# EasyEDA Pro project 主控底板.eprj, schematic TMS320F28335_v1

## Sheets
1 coreboard: Board Name: TMS320F28335
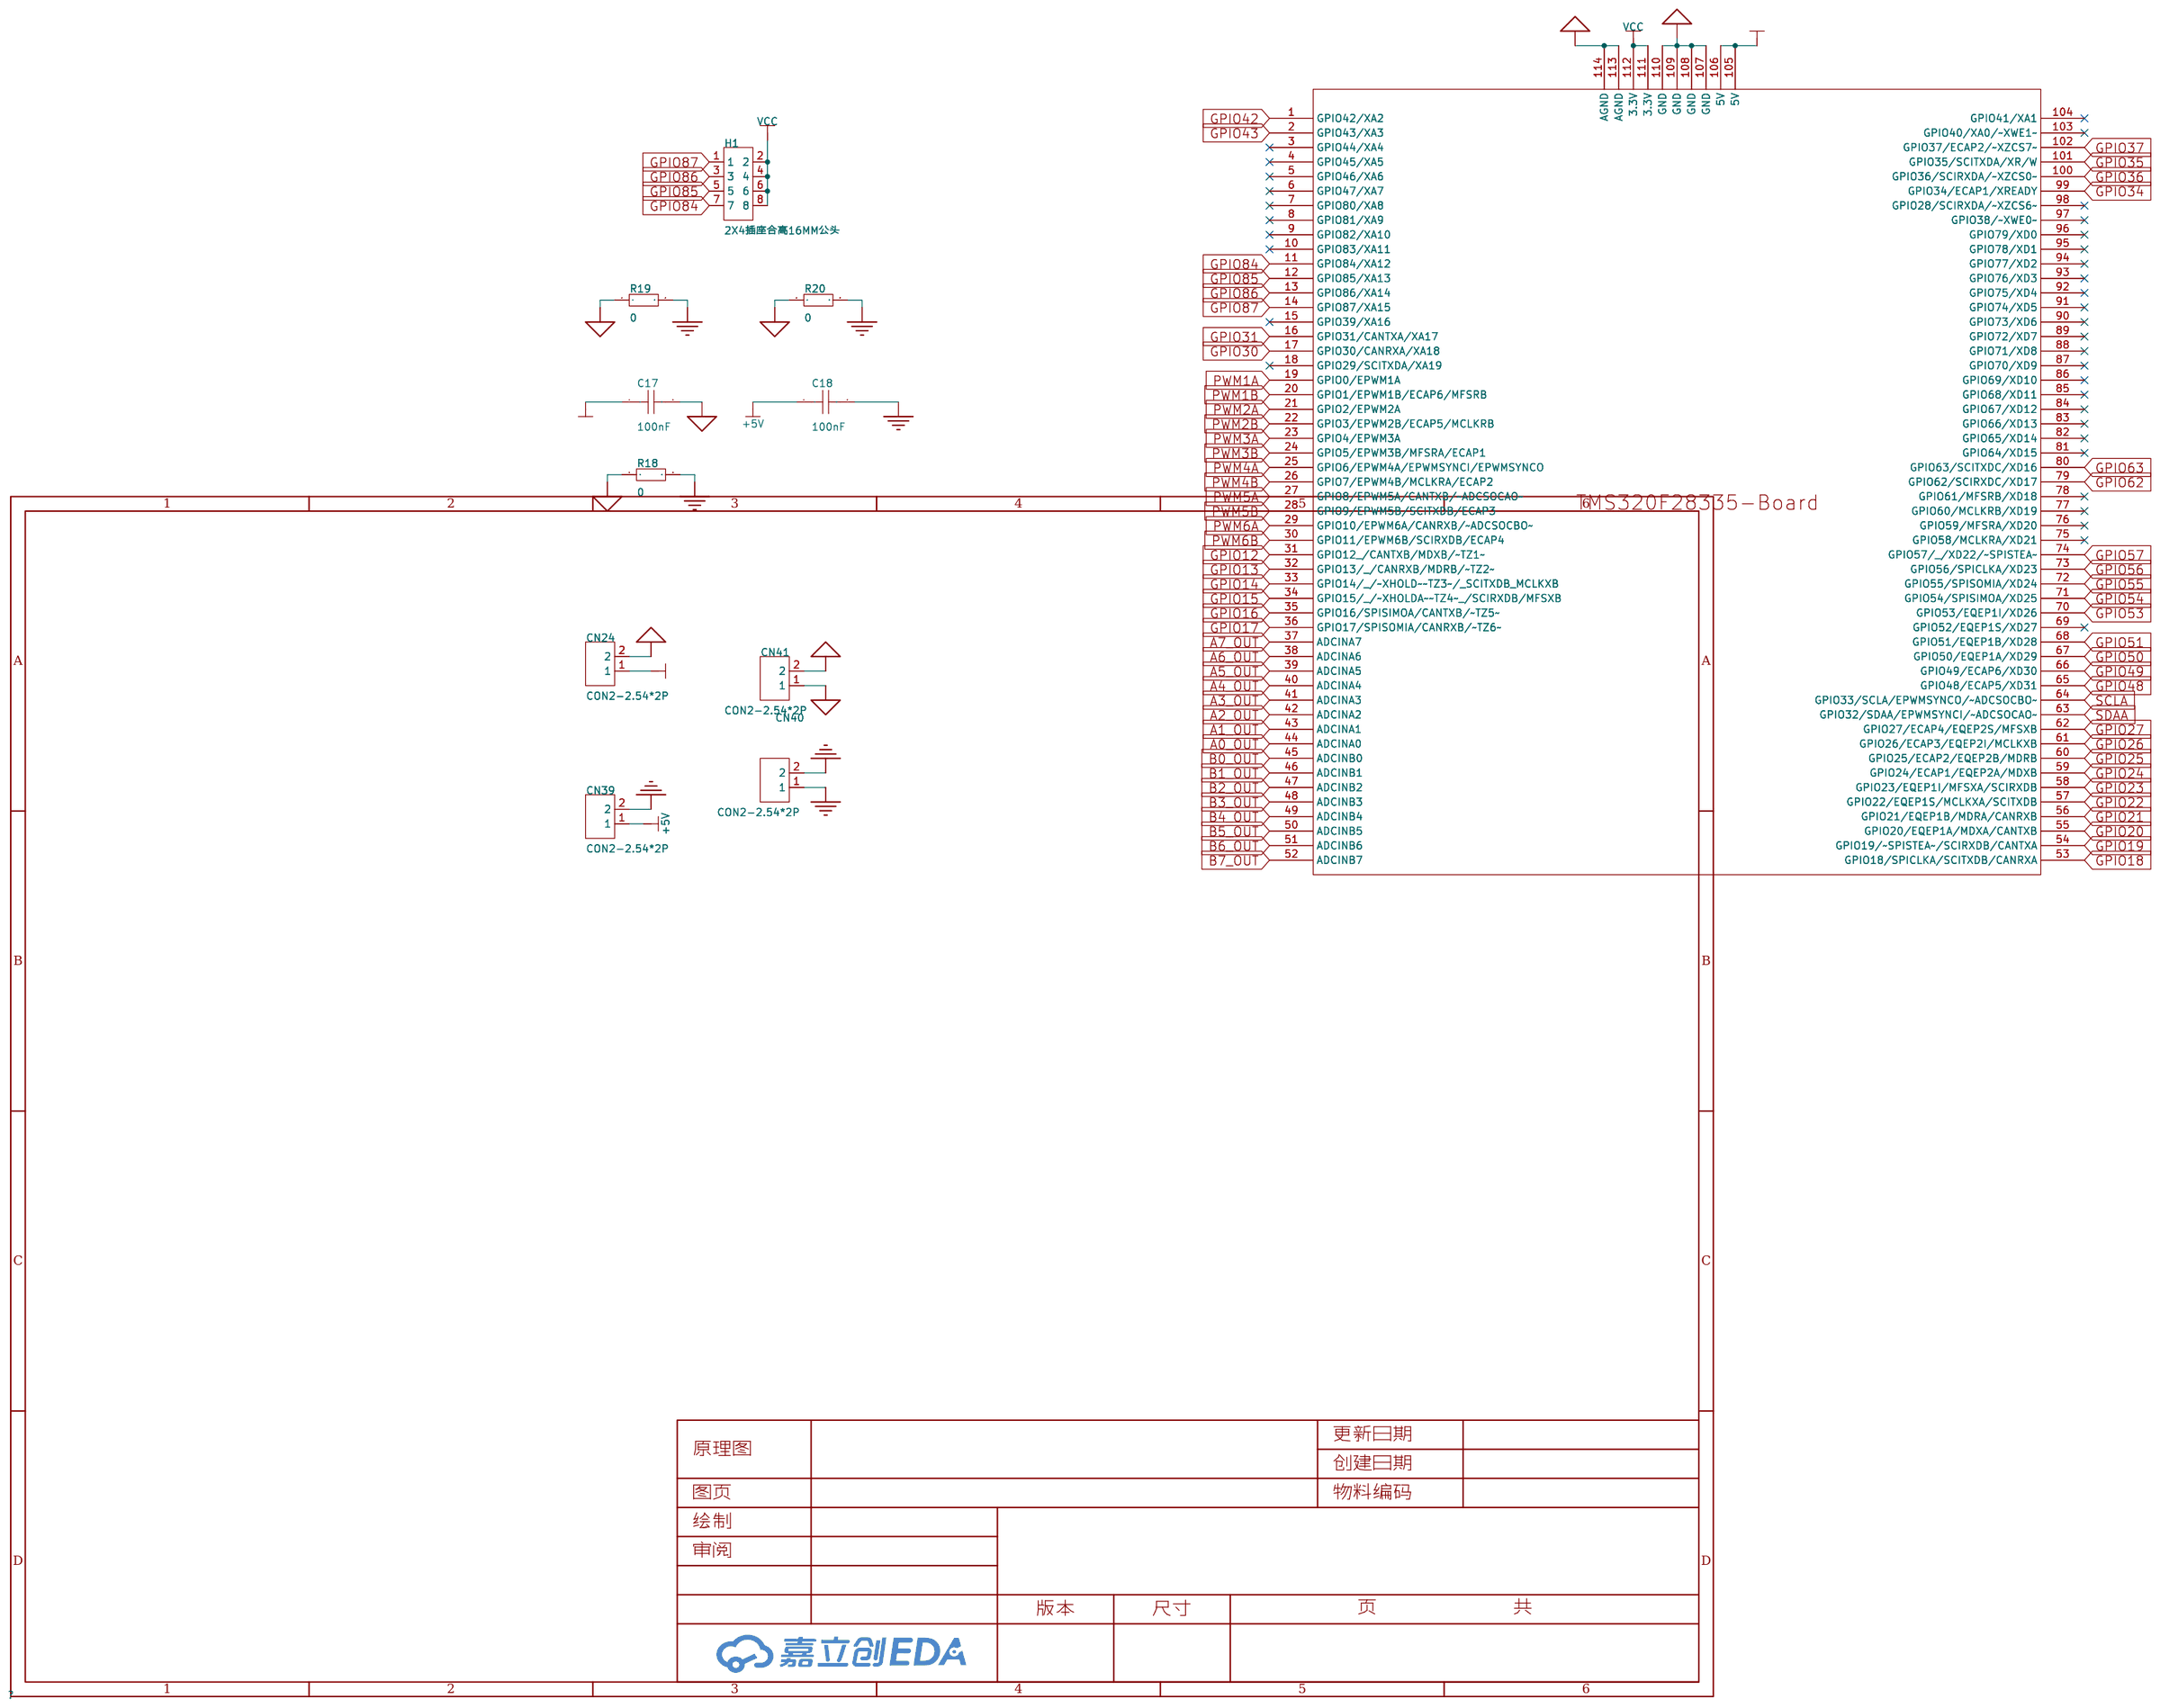
[diagram p0: coreboard]
2 adc: Create Date: 2025-05-22
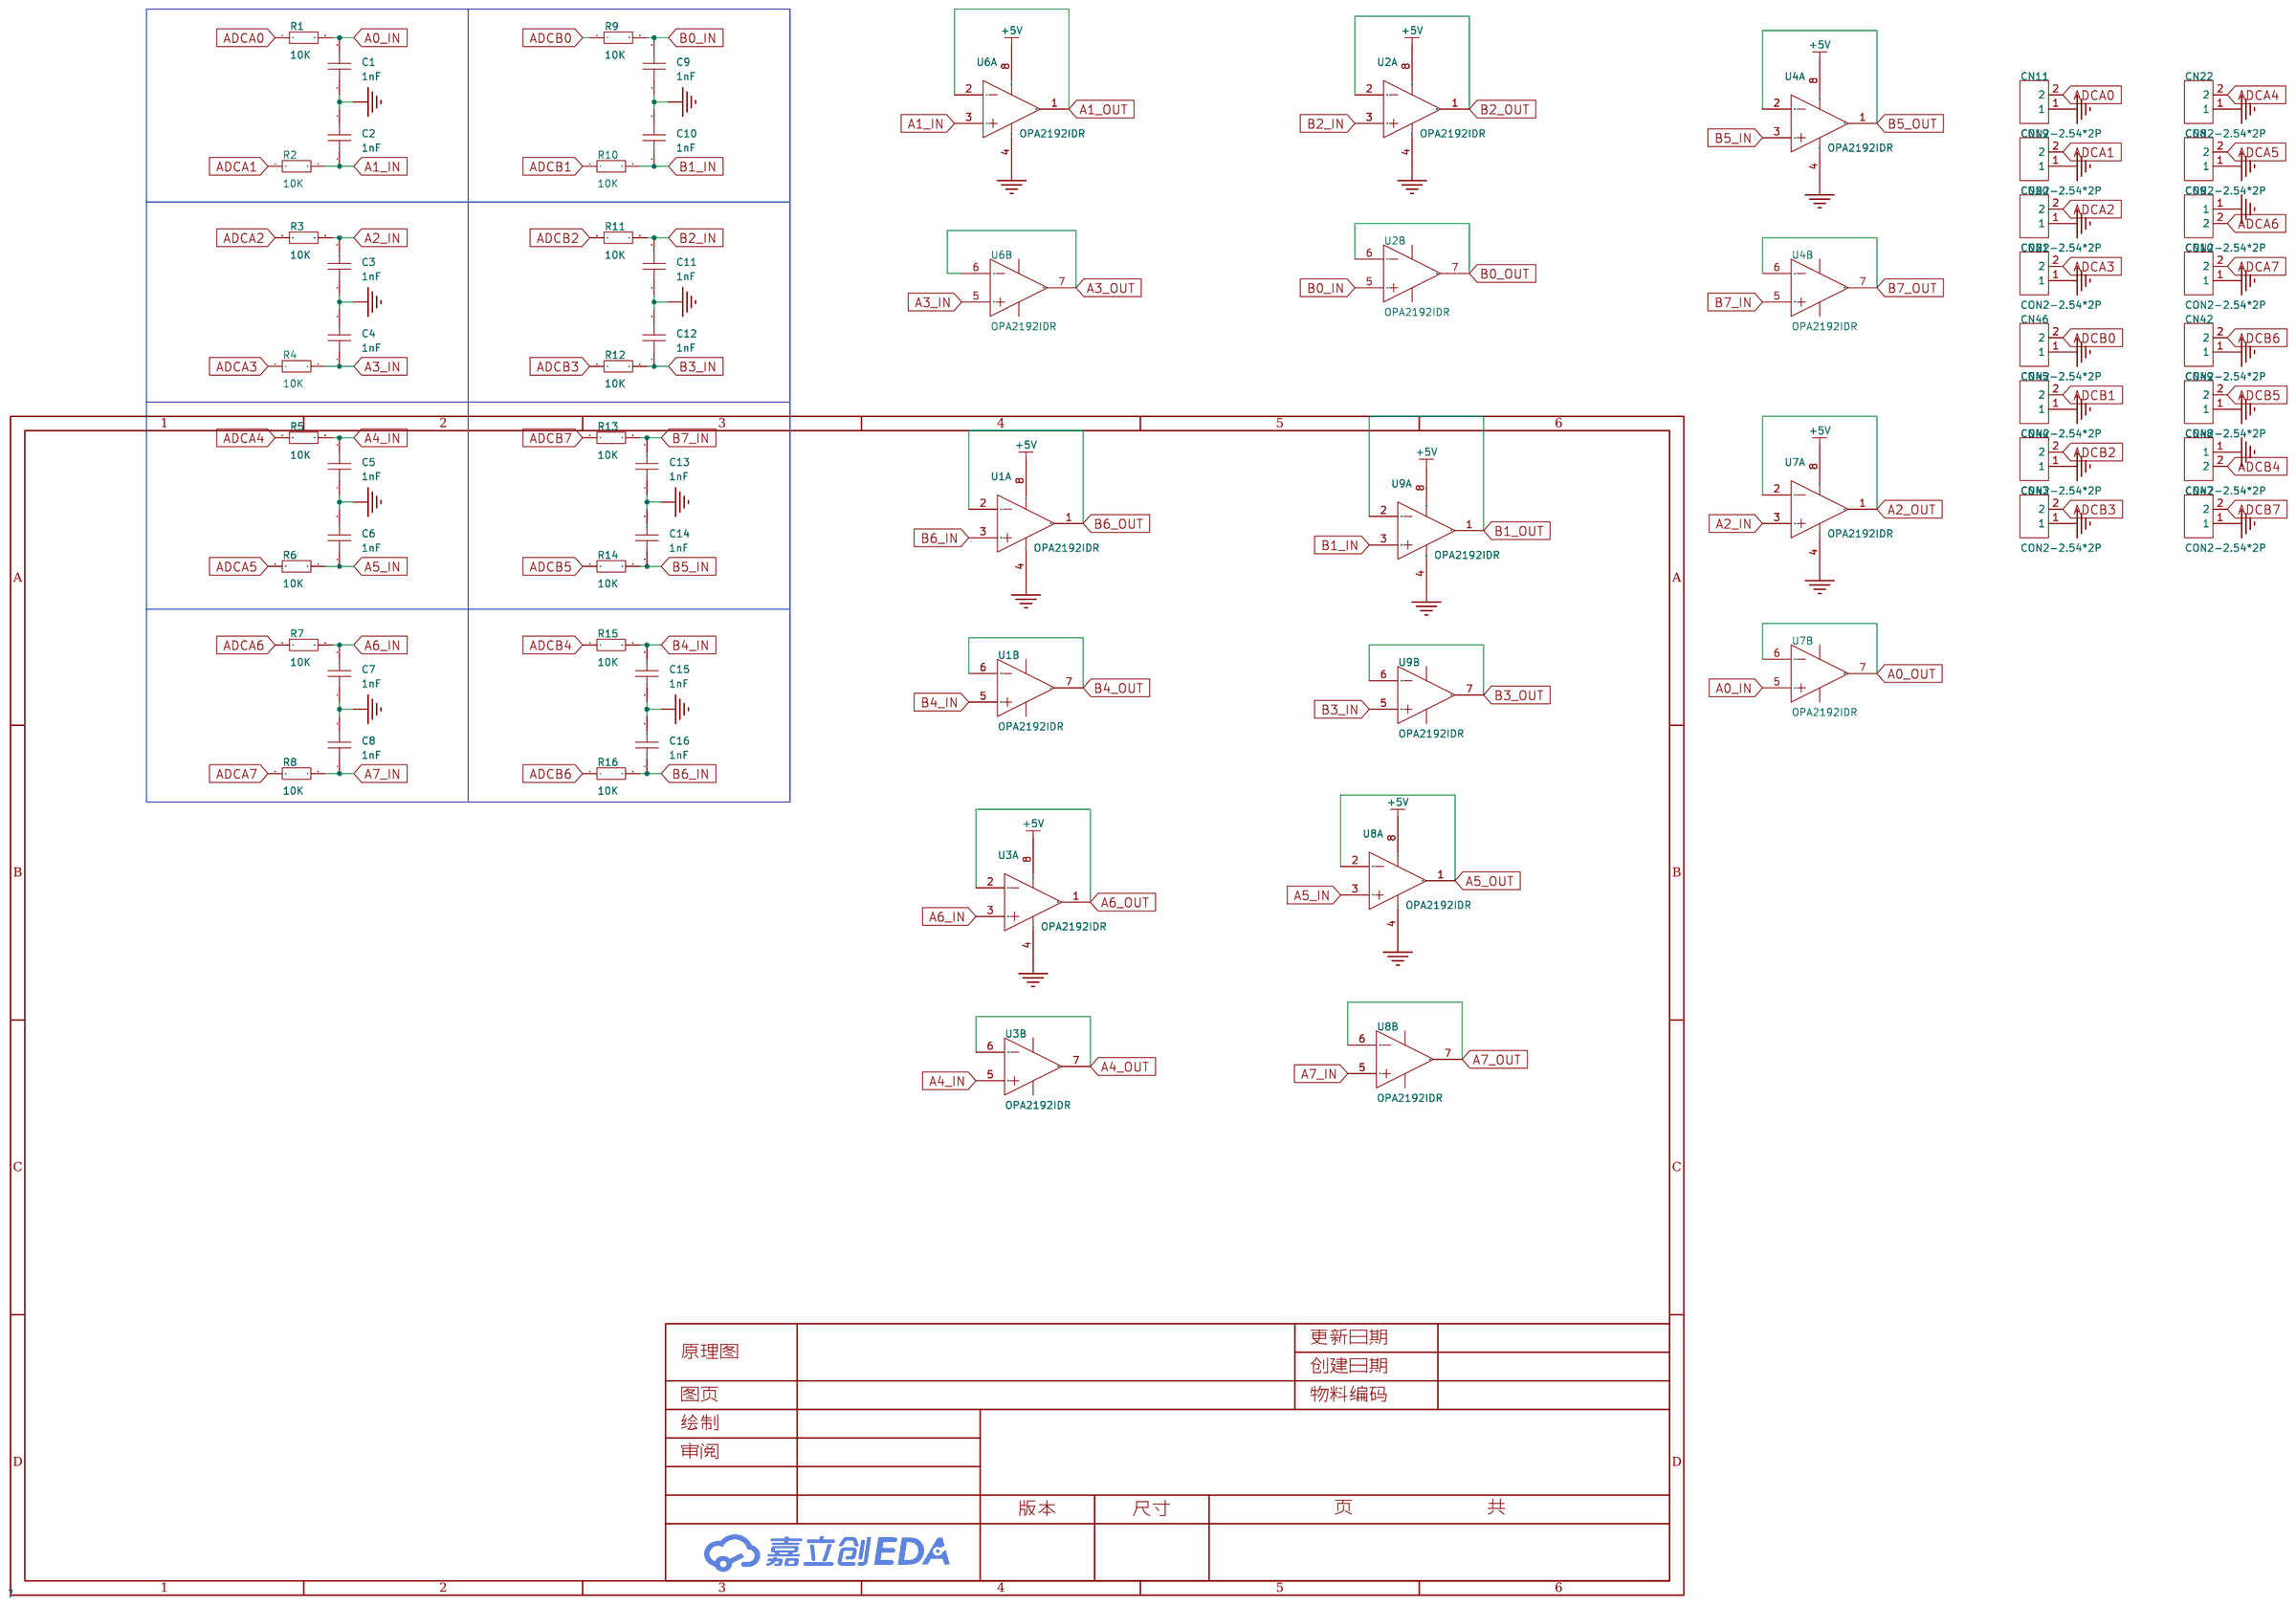
[diagram p1: adc]
3 gpio: Create Date: 2025-05-22
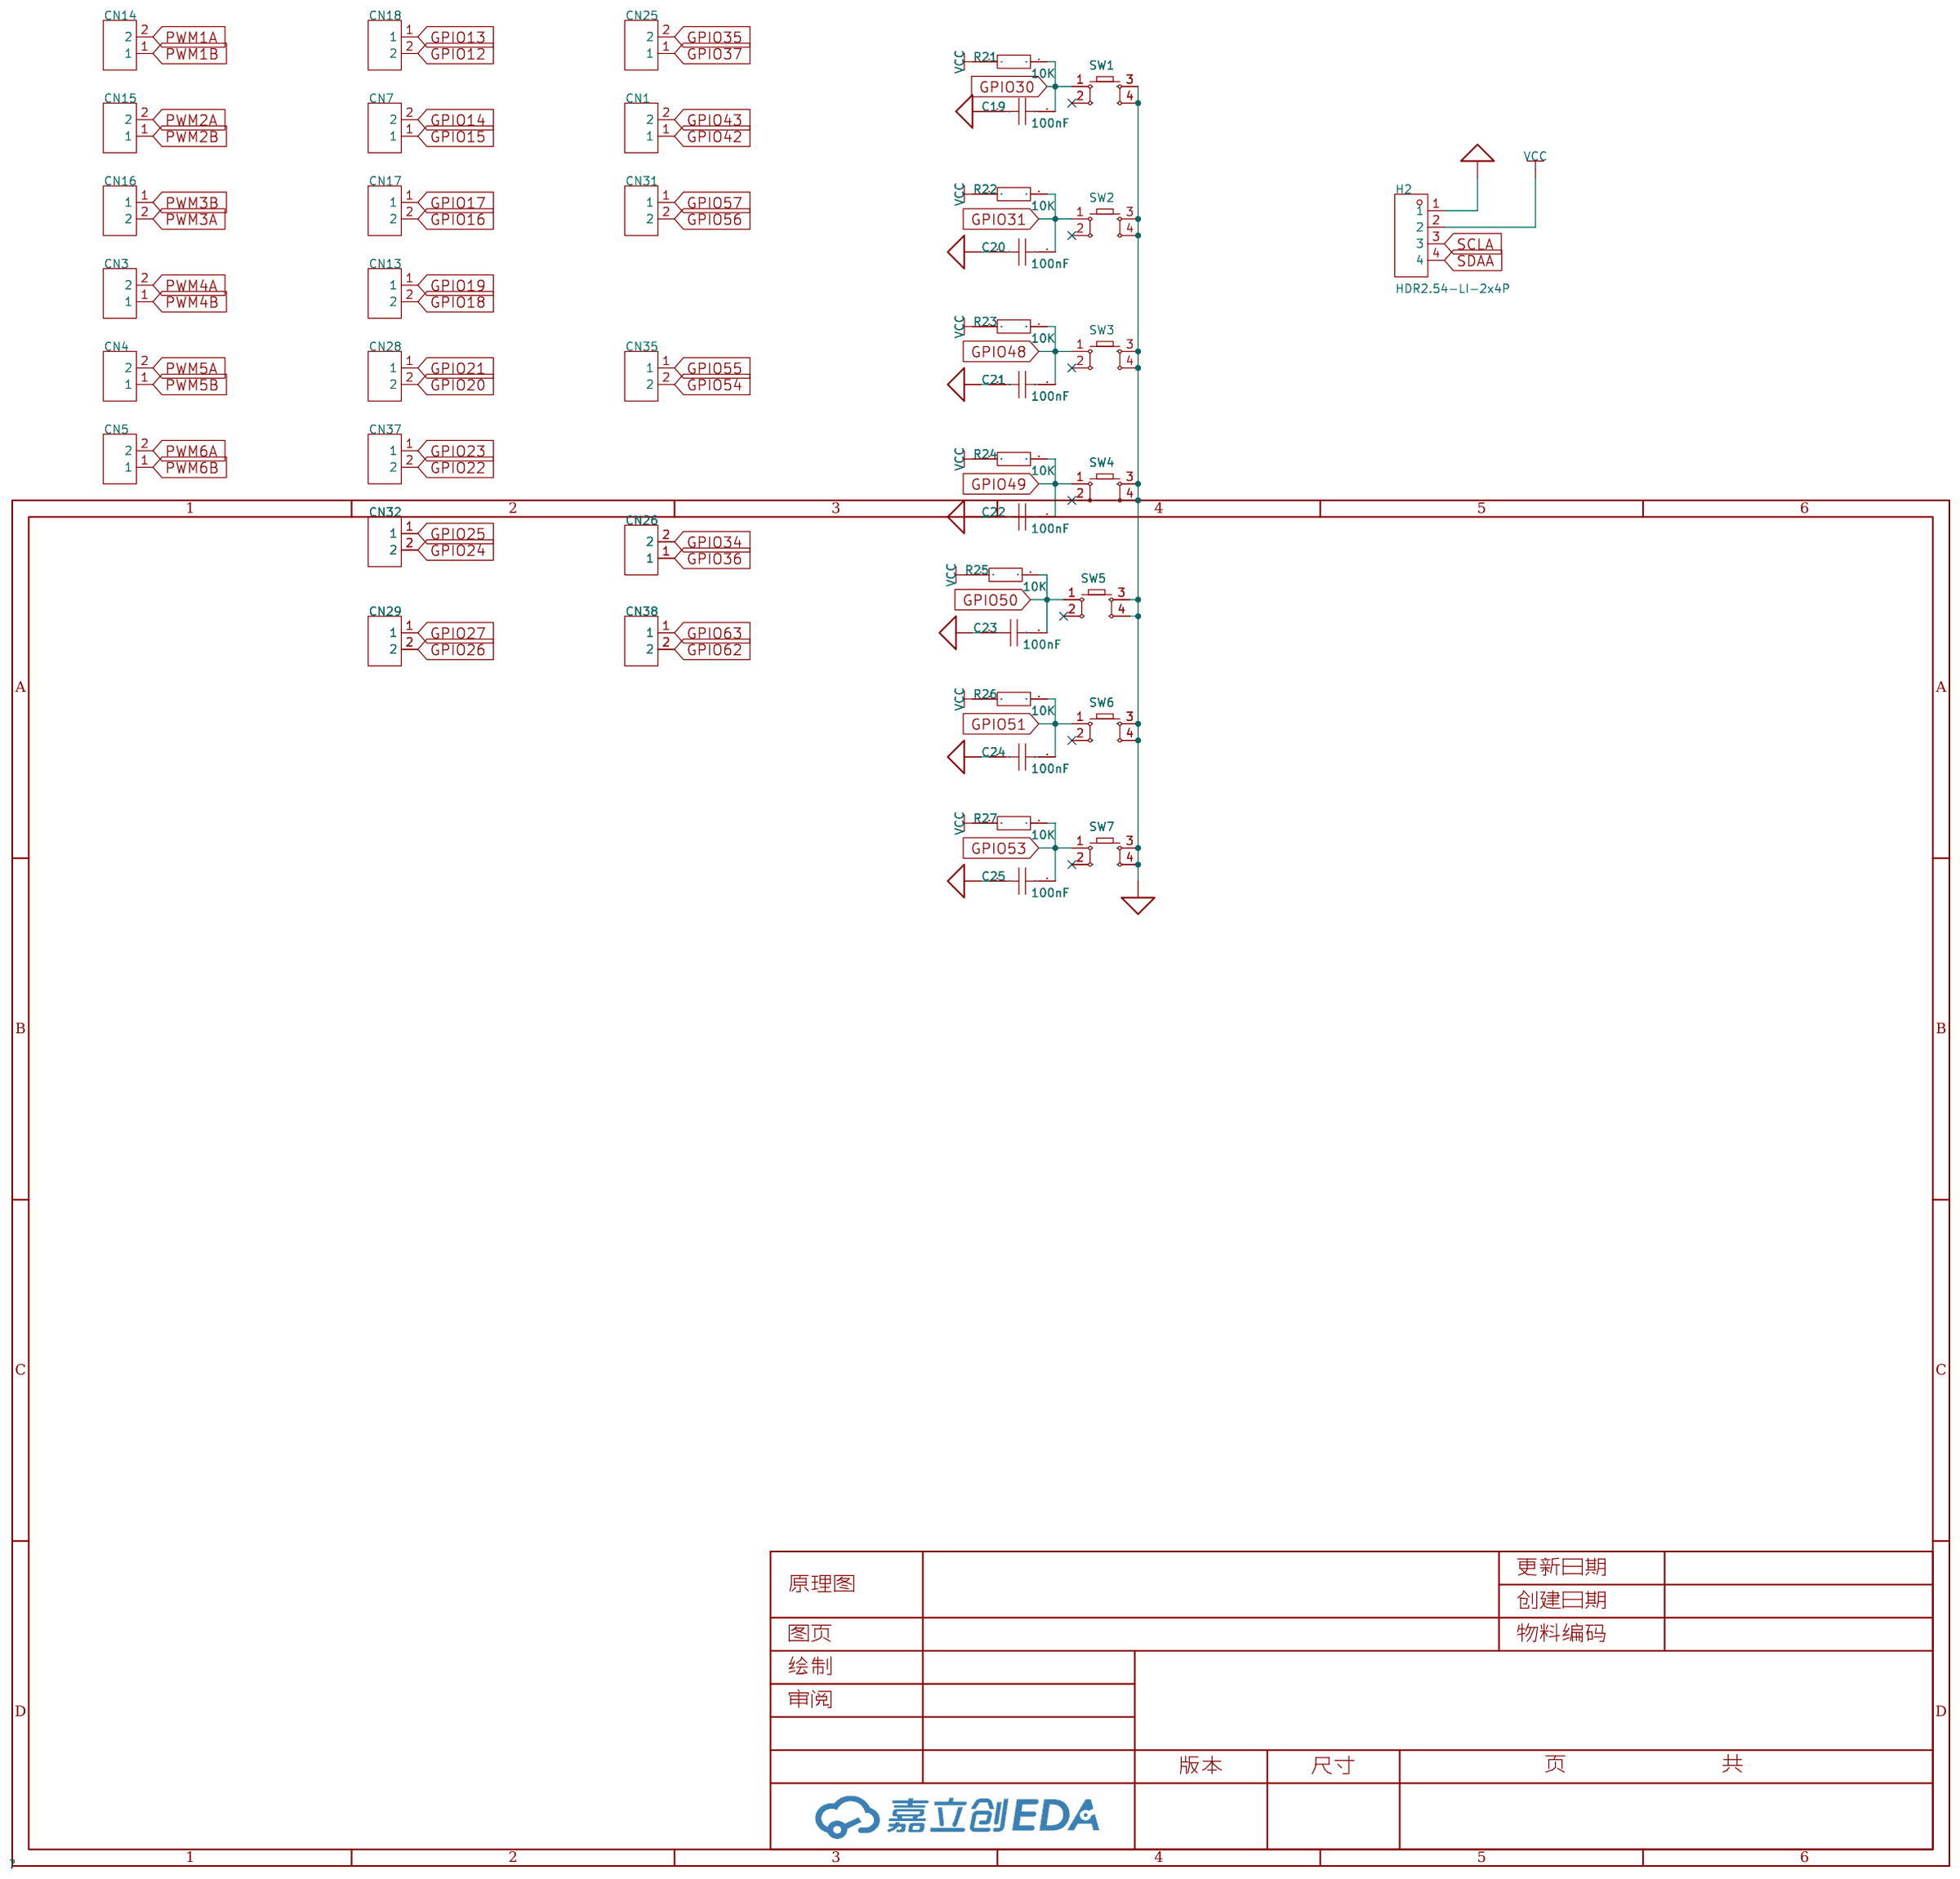
[diagram p2: gpio]

## Parts
sheet adc
C1  1nF  [C0805]
C2  1nF  [C0805]
C3  1nF  [C0805]
C4  1nF  [C0805]
C5  1nF  [C0805]
C6  1nF  [C0805]
C7  1nF  [C0805]
C8  1nF  [C0805]
C9  1nF  [C0805]
C10  1nF  [C0805]
C11  1nF  [C0805]
C12  1nF  [C0805]
C13  1nF  [C0805]
C14  1nF  [C0805]
C15  1nF  [C0805]
C16  1nF  [C0805]
CN8  CON2-2.54*2P  [CONN-TH_2P-P2.54-V]
CN9  CON2-2.54*2P  [CONN-TH_2P-P2.54-V]
CN10  CON2-2.54*2P  [CONN-TH_2P-P2.54-V]
CN11  CON2-2.54*2P  [CONN-TH_2P-P2.54-V]
CN19  CON2-2.54*2P  [CONN-TH_2P-P2.54-V]
CN20  CON2-2.54*2P  [CONN-TH_2P-P2.54-V]
CN21  CON2-2.54*2P  [CONN-TH_2P-P2.54-V]
CN22  CON2-2.54*2P  [CONN-TH_2P-P2.54-V]
CN42  CON2-2.54*2P  [CONN-TH_2P-P2.54-V]
CN43  CON2-2.54*2P  [CONN-TH_2P-P2.54-V]
CN44  CON2-2.54*2P  [CONN-TH_2P-P2.54-V]
CN45  CON2-2.54*2P  [CONN-TH_2P-P2.54-V]
CN46  CON2-2.54*2P  [CONN-TH_2P-P2.54-V]
CN47  CON2-2.54*2P  [CONN-TH_2P-P2.54-V]
CN48  CON2-2.54*2P  [CONN-TH_2P-P2.54-V]
CN49  CON2-2.54*2P  [CONN-TH_2P-P2.54-V]
R1  10K  [R0805]
R2  10K  [R0805]
R3  10K  [R0805]
R4  10K  [R0805]
R5  10K  [R0805]
R6  10K  [R0805]
R7  10K  [R0805]
R8  10K  [R0805]
R9  10K  [R0805]
R10  10K  [R0805]
R11  10K  [R0805]
R12  10K  [R0805]
R13  10K  [R0805]
R14  10K  [R0805]
R15  10K  [R0805]
R16  10K  [R0805]
U1  OPA2192IDR  [SOIC-8_L4.9-W3.9-P1.27-LS6.0-BL]  (sections 1,2)
U2  OPA2192IDR  [SOIC-8_L4.9-W3.9-P1.27-LS6.0-BL]  (sections 1,2)
U3  OPA2192IDR  [SOIC-8_L4.9-W3.9-P1.27-LS6.0-BL]  (sections 1,2)
U4  OPA2192IDR  [SOIC-8_L4.9-W3.9-P1.27-LS6.0-BL]  (sections 1,2)
U6  OPA2192IDR  [SOIC-8_L4.9-W3.9-P1.27-LS6.0-BL]  (sections 1,2)
U7  OPA2192IDR  [SOIC-8_L4.9-W3.9-P1.27-LS6.0-BL]  (sections 1,2)
U8  OPA2192IDR  [SOIC-8_L4.9-W3.9-P1.27-LS6.0-BL]  (sections 1,2)
U9  OPA2192IDR  [SOIC-8_L4.9-W3.9-P1.27-LS6.0-BL]  (sections 1,2)
sheet coreboard
C17  100nF  [C0805]
C18  100nF  [C0805]
CN24  CON2-2.54*2P  [CONN-TH_2P-P2.54-V]
CN39  CON2-2.54*2P  [CONN-TH_2P-P2.54-V]
CN40  CON2-2.54*2P  [CONN-TH_2P-P2.54-V]
CN41  CON2-2.54*2P  [CONN-TH_2P-P2.54-V]
H1  2X4插座合高16MM公头  [HDR-TH_8P-P2.54-V-M-R2-C4-S2.54-2]
R18  0  [R0805]
R19  0  [R0805]
R20  0  [R0805]
TMS320F?#1  TMS320F28335_Board  [TMS320F28335]
sheet gpio
C19  100nF  [C0805]
C20  100nF  [C0805]
C21  100nF  [C0805]
C22  100nF  [C0805]
C23  100nF  [C0805]
C24  100nF  [C0805]
C25  100nF  [C0805]
CN1  CON2-2.54*2P  [CONN-TH_2P-P2.54-V]
CN3  CON2-2.54*2P  [CONN-TH_2P-P2.54-V]
CN4  CON2-2.54*2P  [CONN-TH_2P-P2.54-V]
CN5  CON2-2.54*2P  [CONN-TH_2P-P2.54-V]
CN7  CON2-2.54*2P  [CONN-TH_2P-P2.54-V]
CN13  CON2-2.54*2P  [CONN-TH_2P-P2.54-V]
CN14  CON2-2.54*2P  [CONN-TH_2P-P2.54-V]
CN15  CON2-2.54*2P  [CONN-TH_2P-P2.54-V]
CN16  CON2-2.54*2P  [CONN-TH_2P-P2.54-V]
CN17  CON2-2.54*2P  [CONN-TH_2P-P2.54-V]
CN18  CON2-2.54*2P  [CONN-TH_2P-P2.54-V]
CN25  CON2-2.54*2P  [CONN-TH_2P-P2.54-V]
CN26  CON2-2.54*2P  [CONN-TH_2P-P2.54-V]
CN28  CON2-2.54*2P  [CONN-TH_2P-P2.54-V]
CN29  CON2-2.54*2P  [CONN-TH_2P-P2.54-V]
CN31  CON2-2.54*2P  [CONN-TH_2P-P2.54-V]
CN32  CON2-2.54*2P  [CONN-TH_2P-P2.54-V]
CN35  CON2-2.54*2P  [CONN-TH_2P-P2.54-V]
CN37  CON2-2.54*2P  [CONN-TH_2P-P2.54-V]
CN38  CON2-2.54*2P  [CONN-TH_2P-P2.54-V]
H2  HDR2.54-LI-2x4P  [HDR-TH_4P-P2.54-V-M]
R21  10K  [R0805]
R22  10K  [R0805]
R23  10K  [R0805]
R24  10K  [R0805]
R25  10K  [R0805]
R26  10K  [R0805]
R27  10K  [R0805]
SW1  -  [SW-SMD_4P-L6.0-W6.0-P4.50-LS9.0-2]
SW2  -  [SW-SMD_4P-L6.0-W6.0-P4.50-LS9.0-2]
SW3  -  [SW-SMD_4P-L6.0-W6.0-P4.50-LS9.0-2]
SW4  -  [SW-SMD_4P-L6.0-W6.0-P4.50-LS9.0-2]
SW5  -  [SW-SMD_4P-L6.0-W6.0-P4.50-LS9.0-2]
SW6  -  [SW-SMD_4P-L6.0-W6.0-P4.50-LS9.0-2]
SW7  -  [SW-SMD_4P-L6.0-W6.0-P4.50-LS9.0-2]

## Library data of the parts
C1-C25 = CAP_0805: Supplier Footprint: 0805
CN1 CN3-CN5 CN7-CN11 CN13-CN22 CN24-CN26 CN28 CN29 CN31 CN32 CN35 CN37-CN49 = CON2-2.54*2P: Supplier Part: C9900003238; Supplier Footprint: TH-2P; JLCPCB Part Class: Extended Part; Supplier: LCSC
R1-R16 R18-R27 = Res_0805: Supplier Footprint: 0805
U1-U4 U6-U9 = OPA2192IDR: 放大器数:双路;增益带宽积(GBP):10MHz;输入偏置电流(Ib):5pA;输入失调电压(Vos):-;压摆率(SR):20V/us;带宽(-3db):-;轨到轨:轨到轨输入输出;; Supplier Part: C110074; Manufacturer: TI(德州仪器); Supplier Footprint: SOIC-8; JLCPCB Part Class: 扩展库; Datasheet: https://www.ti.com/cn/lit/gpn/opa2192; Supplier: LCSC; Number of Circuits: 双路; Gain Bandwidth Product(GBP): 10MHz; Current - Input Bias(Ib): 5pA; Slew Rate(SR): 20V/us; Output Current: 65mA; Rail to Rail: 轨到轨输入输出; Supply Current: 1mA; Operating Temperature: -40℃~+125℃
H1 = 2X4插座合高16MM公头: Supplier Part: C9900022742; Supplier Footprint: HDR-TH_8P-P2.54-V-M; JLCPCB Part Class: 扩展库; Supplier: LCSC
TMS320F?#1 = TMS320F28335_Board
H2 = HDR2.54-LI-2x4P: Supplier Part: C9900020145; JLCPCB Part Class: 扩展库; Supplier: LCSC
SW1-SW7 = Key_SMD_6x6x6.5: Supplier Footprint: SMD

## Nets
+5V: C18.1 CN39.1 U1.8(VDD) U2.8(VDD) U3.8(VDD) U4.8(VDD) U6.8(VDD) U7.8(VDD) U8.8(VDD) U9.8(VDD)
+5V_D: C17.1 CN24.1 TMS320F?#1.105(5V) TMS320F?#1.106(5V)
AGND: C17.2 C19.1 C20.1 C21.1 C22.1 C23.1 C24.1 C25.1 CN24.2 CN41.1 CN41.2 H2.1 R18.1 R19.1 R20.1 SW1.3 SW1.4 SW2.3 SW2.4 SW3.3 SW3.4 SW4.3 SW4.4 SW5.3 SW5.4 SW6.3 SW6.4 SW7.3 SW7.4 TMS320F?#1.107(GND) TMS320F?#1.108(GND) TMS320F?#1.109(GND) TMS320F?#1.110(GND) TMS320F?#1.113(AGND) TMS320F?#1.114(AGND)
GND: C1.1 C2.2 C3.1 C4.2 C5.1 C6.2 C7.1 C8.2 C9.1 C10.2 C11.1 C12.2 C13.1 C14.2 C15.1 C16.2 C18.2 CN8.1 CN9.1 CN10.1 CN11.1 CN19.1 CN20.1 CN21.1 CN22.1 CN39.2 CN40.1 CN40.2 CN42.1 CN43.1 CN44.1 CN45.1 CN46.1 CN47.1 CN48.1 CN49.1 R18.2 R19.2 R20.2 U1.4(VSS) U2.4(VSS) U3.4(VSS) U4.4(VSS) U6.4(VSS) U7.4(VSS) U8.4(VSS) U9.4(VSS)
VCC: H1.2 H1.4 H1.6 H1.8 H2.2 R21.1 R22.1 R23.1 R24.1 R25.1 R26.1 R27.1 TMS320F?#1.111(3.3V) TMS320F?#1.112(3.3V)
A0_IN: C1.2 R1.2 U7.5(VINB+)
A0_OUT: TMS320F?#1.44(ADCINA0) U7.6(VINB-) U7.7(VOUTB)
A1_IN: C2.1 R2.2 U6.3(VINA+)
A1_OUT: TMS320F?#1.43(ADCINA1) U6.1(VOUTA) U6.2(VINA-)
A2_IN: C3.2 R3.2 U7.3(VINA+)
A2_OUT: TMS320F?#1.42(ADCINA2) U7.1(VOUTA) U7.2(VINA-)
A3_IN: C4.1 R4.2 U6.5(VINB+)
A3_OUT: TMS320F?#1.41(ADCINA3) U6.6(VINB-) U6.7(VOUTB)
A4_IN: C5.2 R5.2 U3.5(VINB+)
A4_OUT: TMS320F?#1.40(ADCINA4) U3.6(VINB-) U3.7(VOUTB)
A5_IN: C6.1 R6.2 U8.3(VINA+)
A5_OUT: TMS320F?#1.39(ADCINA5) U8.1(VOUTA) U8.2(VINA-)
A6_IN: C7.2 R7.2 U3.3(VINA+)
A6_OUT: TMS320F?#1.38(ADCINA6) U3.1(VOUTA) U3.2(VINA-)
A7_IN: C8.1 R8.2 U8.5(VINB+)
A7_OUT: TMS320F?#1.37(ADCINA7) U8.6(VINB-) U8.7(VOUTB)
ADCA0: CN11.2 R1.1
ADCA1: CN19.2 R2.1
ADCA2: CN20.2 R3.1
ADCA3: CN21.2 R4.1
ADCA4: CN22.2 R5.1
ADCA5: CN8.2 R6.1
ADCA6: CN9.2 R7.1
ADCA7: CN10.2 R8.1
ADCB0: CN46.2 R9.1
ADCB1: CN45.2 R10.1
ADCB2: CN44.2 R11.1
ADCB3: CN43.2 R12.1
ADCB4: CN48.2 R15.1
ADCB5: CN49.2 R14.1
ADCB6: CN42.2 R16.1
ADCB7: CN47.2 R13.1
B0_IN: C9.2 R9.2 U2.5(VINB+)
B0_OUT: TMS320F?#1.45(ADCINB0) U2.6(VINB-) U2.7(VOUTB)
B1_IN: C10.1 R10.2 U9.3(VINA+)
B1_OUT: TMS320F?#1.46(ADCINB1) U9.1(VOUTA) U9.2(VINA-)
B2_IN: C11.2 R11.2 U2.3(VINA+)
B2_OUT: TMS320F?#1.47(ADCINB2) U2.1(VOUTA) U2.2(VINA-)
B3_IN: C12.1 R12.2 U9.5(VINB+)
B3_OUT: TMS320F?#1.48(ADCINB3) U9.6(VINB-) U9.7(VOUTB)
B4_IN: C15.2 R15.2 U1.5(VINB+)
B4_OUT: TMS320F?#1.49(ADCINB4) U1.6(VINB-) U1.7(VOUTB)
B5_IN: C14.1 R14.2 U4.3(VINA+)
B5_OUT: TMS320F?#1.50(ADCINB5) U4.1(VOUTA) U4.2(VINA-)
B6_IN: C16.1 R16.2 U1.3(VINA+)
B6_OUT: TMS320F?#1.51(ADCINB6) U1.1(VOUTA) U1.2(VINA-)
B7_IN: C13.2 R13.2 U4.5(VINB+)
B7_OUT: TMS320F?#1.52(ADCINB7) U4.6(VINB-) U4.7(VOUTB)
GPIO12: CN18.2 TMS320F?#1.31(GPIO12 /CANTXB/MDXB/~TZ1~)
GPIO13: CN18.1 TMS320F?#1.32(GPIO13/ /CANRXB/MDRB/~TZ2~)
GPIO14: CN7.2 TMS320F?#1.33(GPIO14/ /~XHOLD~~TZ3~/ SCITXDB MCLKXB)
GPIO15: CN7.1 TMS320F?#1.34(GPIO15/ /~XHOLDA~~TZ4~ /SCIRXDB/MFSXB)
GPIO16: CN17.2 TMS320F?#1.35(GPIO16/SPISIMOA/CANTXB/~TZ5~)
GPIO17: CN17.1 TMS320F?#1.36(GPIO17/SPISOMIA/CANRXB/~TZ6~)
GPIO18: CN13.2 TMS320F?#1.53(GPIO18/SPICLKA/SCITXDB/CANRXA)
GPIO19: CN13.1 TMS320F?#1.54(GPIO19/~SPISTEA~/SCIRXDB/CANTXA)
GPIO20: CN28.2 TMS320F?#1.55(GPIO20/EQEP1A/MDXA/CANTXB)
GPIO21: CN28.1 TMS320F?#1.56(GPIO21/EQEP1B/MDRA/CANRXB)
GPIO22: CN37.2 TMS320F?#1.57(GPIO22/EQEP1S/MCLKXA/SCITXDB)
GPIO23: CN37.1 TMS320F?#1.58(GPIO23/EQEP1I/MFSXA/SCIRXDB)
GPIO24: CN32.2 TMS320F?#1.59(GPIO24/ECAP1/EQEP2A/MDXB)
GPIO25: CN32.1 TMS320F?#1.60(GPIO25/ECAP2/EQEP2B/MDRB)
GPIO26: CN29.2 TMS320F?#1.61(GPIO26/ECAP3/EQEP2I/MCLKXB)
GPIO27: CN29.1 TMS320F?#1.62(GPIO27/ECAP4/EQEP2S/MFSXB)
GPIO30: C19.2 R21.2 SW1.1 TMS320F?#1.17(GPIO30/CANRXA/XA18)
GPIO31: C20.2 R22.2 SW2.1 TMS320F?#1.16(GPIO31/CANTXA/XA17)
GPIO34: CN26.2 TMS320F?#1.99(GPIO34/ECAP1/XREADY)
GPIO35: CN25.2 TMS320F?#1.101(GPIO35/SCITXDA/XR/W)
GPIO36: CN26.1 TMS320F?#1.100(GPIO36/SCIRXDA/~XZCS0~)
GPIO37: CN25.1 TMS320F?#1.102(GPIO37/ECAP2/~XZCS7~)
GPIO42: CN1.1 TMS320F?#1.1(GPIO42/XA2)
GPIO43: CN1.2 TMS320F?#1.2(GPIO43/XA3)
GPIO48: C21.2 R23.2 SW3.1 TMS320F?#1.65(GPIO48/ECAP5/XD31)
GPIO49: C22.2 R24.2 SW4.1 TMS320F?#1.66(GPIO49/ECAP6/XD30)
GPIO50: C23.2 R25.2 SW5.1 TMS320F?#1.67(GPIO50/EQEP1A/XD29)
GPIO51: C24.2 R26.2 SW6.1 TMS320F?#1.68(GPIO51/EQEP1B/XD28)
GPIO53: C25.2 R27.2 SW7.1 TMS320F?#1.70(GPIO53/EQEP1I/XD26)
GPIO54: CN35.2 TMS320F?#1.71(GPIO54/SPISIMOA/XD25)
GPIO55: CN35.1 TMS320F?#1.72(GPIO55/SPISOMIA/XD24)
GPIO56: CN31.2 TMS320F?#1.73(GPIO56/SPICLKA/XD23)
GPIO57: CN31.1 TMS320F?#1.74(GPIO57/ /XD22/~SPISTEA~)
GPIO62: CN38.2 TMS320F?#1.79(GPIO62/SCIRXDC/XD17)
GPIO63: CN38.1 TMS320F?#1.80(GPIO63/SCITXDC/XD16)
GPIO84: H1.7 TMS320F?#1.11(GPIO84/XA12)
GPIO85: H1.5 TMS320F?#1.12(GPIO85/XA13)
GPIO86: H1.3 TMS320F?#1.13(GPIO86/XA14)
GPIO87: H1.1 TMS320F?#1.14(GPIO87/XA15)
PWM1A: CN14.2 TMS320F?#1.19(GPIO0/EPWM1A)
PWM1B: CN14.1 TMS320F?#1.20(GPIO1/EPWM1B/ECAP6/MFSRB)
PWM2A: CN15.2 TMS320F?#1.21(GPIO2/EPWM2A)
PWM2B: CN15.1 TMS320F?#1.22(GPIO3/EPWM2B/ECAP5/MCLKRB)
PWM3A: CN16.2 TMS320F?#1.23(GPIO4/EPWM3A)
PWM3B: CN16.1 TMS320F?#1.24(GPIO5/EPWM3B/MFSRA/ECAP1)
PWM4A: CN3.2 TMS320F?#1.25(GPIO6/EPWM4A/EPWMSYNCI/EPWMSYNCO)
PWM4B: CN3.1 TMS320F?#1.26(GPIO7/EPWM4B/MCLKRA/ECAP2)
PWM5A: CN4.2 TMS320F?#1.27(GPIO8/EPWM5A/CANTXB/~ADCSOCAO~)
PWM5B: CN4.1 TMS320F?#1.28(GPIO9/EPWM5B/SCITXDB/ECAP3)
PWM6A: CN5.2 TMS320F?#1.29(GPIO10/EPWM6A/CANRXB/~ADCSOCBO~)
PWM6B: CN5.1 TMS320F?#1.30(GPIO11/EPWM6B/SCIRXDB/ECAP4)
SCLA: H2.3 TMS320F?#1.64(GPIO33/SCLA/EPWMSYNCO/~ADCSOCBO~)
SDAA: H2.4 TMS320F?#1.63(GPIO32/SDAA/EPWMSYNCI/~ADCSOCAO~)

Not connected (* = marked no-connect by the designer): SW1 2*; SW2 2*; SW3 2*; SW4 2*; SW5 2*; SW6 2*; SW7 2*; TMS320F?#1 3(GPIO44/XA4)* 4(GPIO45/XA5)* 5(GPIO46/XA6)* 6(GPIO47/XA7)* 7(GPIO80/XA8)* 8(GPIO81/XA9)* 9(GPIO82/XA10)* 10(GPIO83/XA11)* 15(GPIO39/XA16)* 18(GPIO29/SCITXDA/XA19)* 69(GPIO52/EQEP1S/XD27)* 75(GPIO58/MCLKRA/XD21)* 76(GPIO59/MFSRA/XD20)* 77(GPIO60/MCLKRB/XD19)* 78(GPIO61/MFSRB/XD18)* 81(GPIO64/XD15)* 82(GPIO65/XD14)* 83(GPIO66/XD13)* 84(GPIO67/XD12)* 85(GPIO68/XD11)* 86(GPIO69/XD10)* 87(GPIO70/XD9)* 88(GPIO71/XD8)* 89(GPIO72/XD7)* 90(GPIO73/XD6)* 91(GPIO74/XD5)* 92(GPIO75/XD4)* 93(GPIO76/XD3)* 94(GPIO77/XD2)* 95(GPIO78/XD1)* 96(GPIO79/XD0)* 97(GPIO38/~XWE0~)* 98(GPIO28/SCIRXDA/~XZCS6~)* 103(GPIO40/XA0/~XWE1~)* 104(GPIO41/XA1)*
